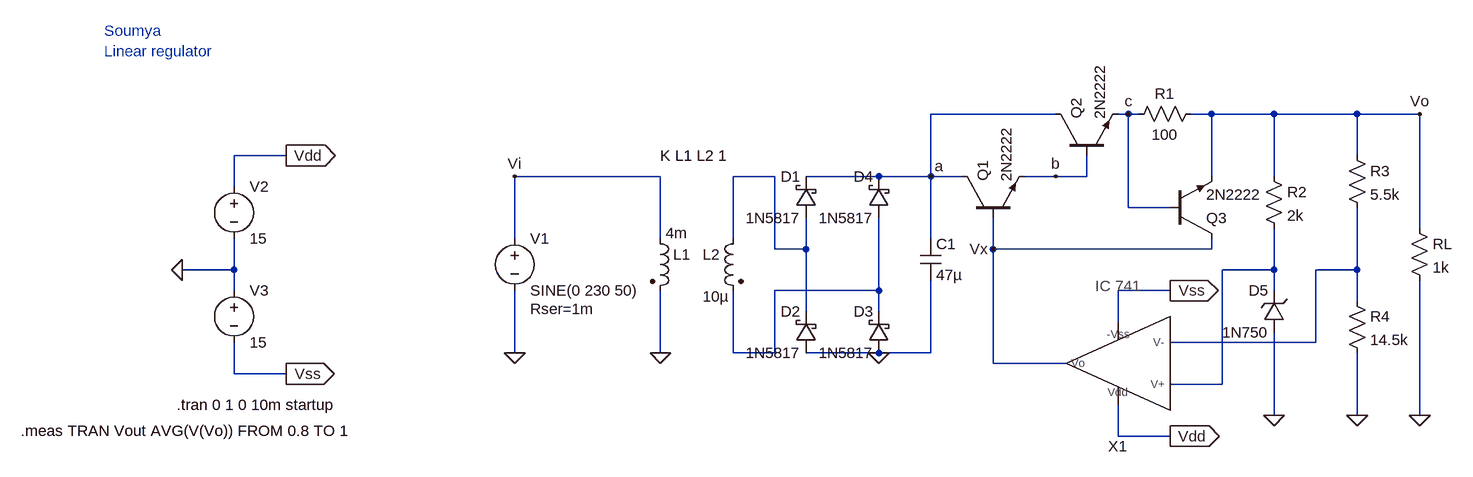
[diagram p0: schematic linear regulator.asc]
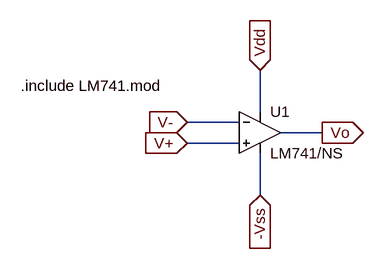
[diagram p1: sub-circuit ic741.asc]
linear regulator.asc, the LTspice schematic file:
Version 4
SHEET 1 1348 736
WIRE 720 -48 528 -48
WIRE 832 -48 816 -48
WIRE 848 -48 832 -48
WIRE 960 -48 928 -48
WIRE 1056 -48 960 -48
WIRE 1184 -48 1056 -48
WIRE 1280 -48 1184 -48
WIRE -464 16 -544 16
WIRE 1184 16 1184 -48
WIRE 112 48 -112 48
WIRE 288 48 224 48
WIRE 448 48 336 48
WIRE 528 48 528 -48
WIRE 528 48 448 48
WIRE 576 48 528 48
WIRE 720 48 672 48
WIRE 768 48 768 16
WIRE 768 48 720 48
WIRE 960 48 960 -48
WIRE 1056 48 1056 -48
WIRE -544 64 -544 16
WIRE 832 96 832 -48
WIRE 896 96 832 96
WIRE 1280 128 1280 -48
WIRE -112 144 -112 48
WIRE 112 144 112 48
WIRE 224 144 224 48
WIRE 528 144 528 48
WIRE 288 160 288 48
WIRE 336 160 336 112
WIRE 336 160 288 160
WIRE 624 160 624 112
WIRE 960 160 960 144
WIRE 960 160 624 160
WIRE -544 192 -544 144
WIRE -544 192 -624 192
WIRE 1056 192 1056 128
WIRE 1056 192 976 192
WIRE 1184 192 1184 96
WIRE 1184 192 1120 192
WIRE -544 224 -544 192
WIRE 448 224 448 112
WIRE 448 224 288 224
WIRE 896 224 816 224
WIRE 1056 224 1056 192
WIRE 1184 240 1184 192
WIRE 336 256 336 160
WIRE 448 256 448 224
WIRE 816 272 816 224
WIRE 1120 304 1120 192
WIRE 1120 304 896 304
WIRE -112 320 -112 224
WIRE 112 320 112 224
WIRE 224 320 224 224
WIRE 288 320 288 224
WIRE 288 320 224 320
WIRE 448 320 336 320
WIRE 528 320 528 208
WIRE 528 320 448 320
WIRE 624 336 624 160
WIRE 736 336 624 336
WIRE -544 352 -544 304
WIRE -464 352 -544 352
WIRE 976 368 976 192
WIRE 976 368 896 368
WIRE 1056 416 1056 288
WIRE 1184 416 1184 320
WIRE 1280 416 1280 208
WIRE 816 448 816 400
WIRE 896 448 816 448
FLAG 448 320 0
FLAG 112 320 0
FLAG -112 320 0
FLAG 1056 416 0
FLAG 1184 416 0
FLAG 1280 416 0
FLAG -624 192 0
FLAG -464 16 Vdd
IOPIN -464 16 Out
FLAG -464 352 Vss
IOPIN -464 352 Out
FLAG 896 224 Vss
IOPIN 896 224 Out
FLAG 1280 -48 Vo
FLAG -112 48 Vi
FLAG 896 448 Vdd
IOPIN 896 448 Out
FLAG 832 -48 c
FLAG 528 48 a
FLAG 720 48 b
FLAG 624 160 Vx
SYMBOL voltage -112 128 R0
WINDOW 123 0 0 Left 0
WINDOW 39 24 124 Left 2
SYMATTR SpiceLine Rser=1m
SYMATTR InstName V1
SYMATTR Value SINE(0 230 50)
SYMBOL ind2 96 128 R0
WINDOW 3 24 7 Left 2
SYMATTR Value 4m
SYMATTR InstName L1
SYMATTR Type ind
SYMBOL ind2 240 128 M0
WINDOW 3 22 105 Left 2
SYMATTR Value 10µ
SYMATTR InstName L2
SYMATTR Type ind
SYMBOL schottky 464 112 R180
WINDOW 0 24 64 Left 2
WINDOW 3 24 0 Left 2
SYMATTR InstName D4
SYMATTR Value 1N5817
SYMATTR Description Diode
SYMATTR Type diode
SYMBOL cap 512 144 R0
SYMATTR InstName C1
SYMATTR Value 47µ
SYMBOL npn 576 112 R270
SYMATTR InstName Q1
SYMATTR Value 2N2222
SYMBOL npn 720 16 R270
SYMATTR InstName Q2
SYMATTR Value 2N2222
SYMBOL npn 896 144 M180
SYMATTR InstName Q3
SYMATTR Value 2N2222
SYMBOL res 832 -32 R270
WINDOW 0 32 56 VTop 2
WINDOW 3 0 56 VBottom 2
SYMATTR InstName R1
SYMATTR Value 100
SYMBOL IC741 816 320 R180
SYMATTR InstName X1
SYMBOL res 1040 32 R0
SYMATTR InstName R2
SYMATTR Value 2k
SYMBOL res 1168 0 R0
SYMATTR InstName R3
SYMATTR Value 5.5k
SYMBOL res 1168 224 R0
SYMATTR InstName R4
SYMATTR Value 14.5k
SYMBOL res 1264 112 R0
SYMATTR InstName RL
SYMATTR Value 1k
SYMBOL zener 1072 288 R180
WINDOW 0 24 64 Left 2
WINDOW 3 24 0 Left 2
SYMATTR InstName D5
SYMATTR Value 1N750
SYMATTR Description Diode
SYMATTR Type diode
SYMBOL schottky 352 112 R180
WINDOW 0 24 64 Left 2
WINDOW 3 24 0 Left 2
SYMATTR InstName D1
SYMATTR Value 1N5817
SYMATTR Description Diode
SYMATTR Type diode
SYMBOL schottky 352 320 R180
WINDOW 0 24 64 Left 2
WINDOW 3 24 0 Left 2
SYMATTR InstName D2
SYMATTR Value 1N5817
SYMATTR Description Diode
SYMATTR Type diode
SYMBOL schottky 464 320 R180
WINDOW 0 24 64 Left 2
WINDOW 3 24 0 Left 2
SYMATTR InstName D3
SYMATTR Value 1N5817
SYMATTR Description Diode
SYMATTR Type diode
SYMBOL voltage -544 48 R0
WINDOW 123 0 0 Left 0
WINDOW 39 0 0 Left 0
SYMATTR InstName V2
SYMATTR Value 15
SYMBOL voltage -544 208 R0
WINDOW 123 0 0 Left 0
WINDOW 39 0 0 Left 0
SYMATTR InstName V3
SYMATTR Value 15
TEXT 112 16 Left 2 !K L1 L2 1
TEXT -632 400 Left 2 !.tran 0 1 0 10m startup
TEXT -872 440 Left 2 !.meas TRAN Vout AVG(V(Vo)) FROM 0.8 TO 1
TEXT -744 -176 Left 2 ;Soumya \nLinear regulator

ic741.asc, the sub-circuit schematic file:
Version 4
SHEET 1 880 680
WIRE 368 128 368 64
WIRE 336 144 256 144
WIRE 464 160 400 160
WIRE 336 176 256 176
WIRE 368 256 368 192
FLAG 464 160 Vo
IOPIN 464 160 Out
FLAG 368 64 Vdd
IOPIN 368 64 In
FLAG 368 256 -Vss
IOPIN 368 256 In
FLAG 256 176 V+
IOPIN 256 176 In
FLAG 256 144 V-
IOPIN 256 144 In
SYMBOL OpAmps\\opamp2 368 96 R0
SYMATTR InstName U1
SYMATTR Value LM741/NS
TEXT 0 88 Left 2 !.include LM741.mod

The netlist it stands for:
* linear regulator.asc
V1 Vi 0 SINE(0 230 50) Rser=1m
L1 Vi 0 4m
L2 N001 N004 10µ
D4 N004 a 1N5817
C1 a 0 47µ
Q1 a Vx b 0 2N2222
Q2 a b c 0 2N2222
Q3 Vx c Vo 0 2N2222
R1 c Vo 100
XX1 Vss N002 N003 Vdd Vx ic741
R2 Vo N002 2k
R3 Vo N003 5.5k
R4 N003 0 14.5k
RL Vo 0 1k
D5 0 N002 1N750
D1 N001 a 1N5817
D2 0 N001 1N5817
D3 0 N004 1N5817
V2 Vdd 0 15
V3 0 Vss 15

* block symbol definitions
.subckt ic741 -Vss V+ V- Vdd Vo
XU1 V+ V- Vdd -Vss Vo LM741/NS  ; pins In+ In- V+ V- OUT
.include LM741.mod
.ends ic741

.model D D
.lib standard.dio
.model NPN NPN
.model PNP PNP
.lib standard.bjt
K L1 L2 1
.tran 0 1 0 10m startup
.meas TRAN Vout AVG(V(Vo)) FROM 0.8 TO 1
* Soumya
* Linear regulator
.backanno
.end